# EAGLE design BSPD Test Board rev5 (EAGLE 8.5.2)
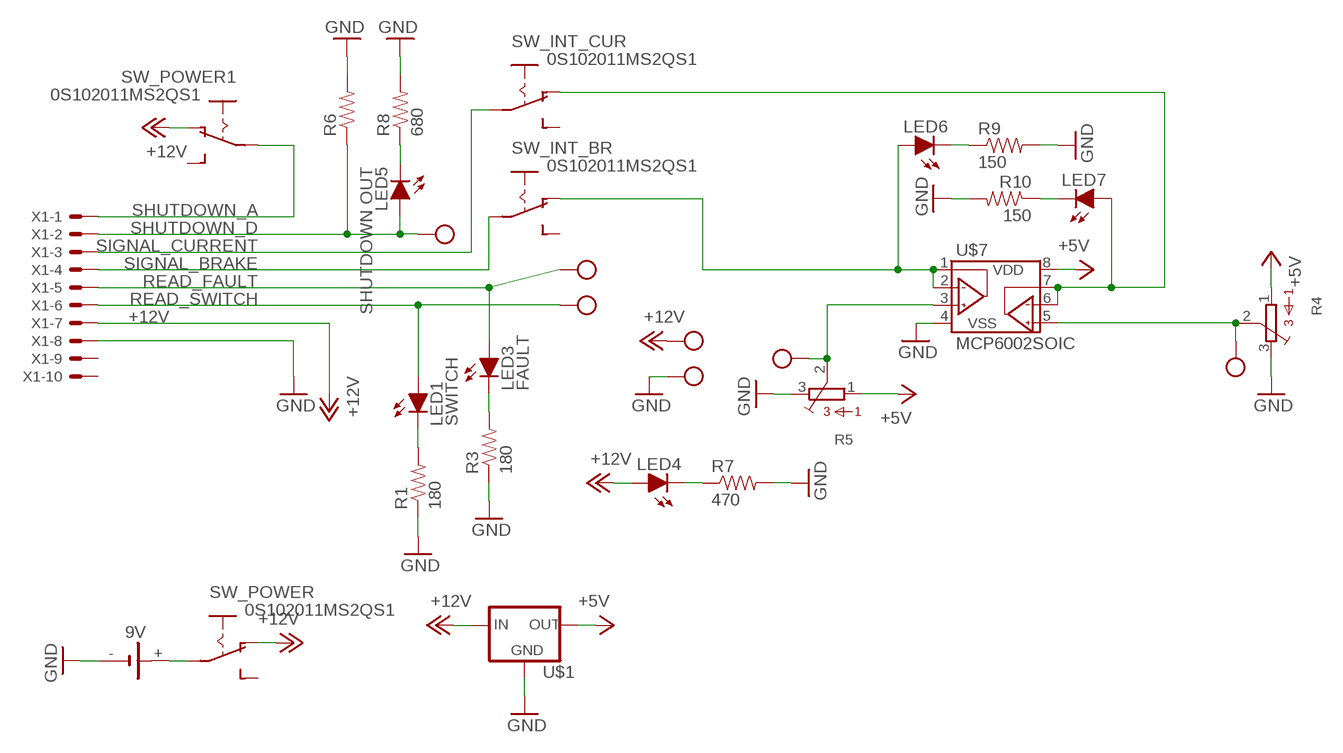
[diagram p0: schematic, sheet 1]

## Parts
9V  1291-79  [1291-79]
LED1  SWITCH  LED-5MM  [LED-5MM]
LED3  FAULT  LED-5MM  [LED-5MM]
LED4  LED-0805  [LED-805]
LED5  SHUTDOWN OUT  LED-5MM  [LED-5MM]
LED6  LED-0805  [LED-805]
LED7  LED-0805  [LED-805]
R1  180  RESISTOR0805-RES  [0805]
R3  180  RESISTOR0805-RES  [0805]
R4  TRIMPOT_3296C  [TRIMPOT_3296]
R5  TRIMPOT_3296C  [TRIMPOT_3296]
R6  RESISTORPTH-1/2W  [AXIAL-0.5]
R7  470  RESISTOR0805-RES  [0805]
R8  680  RESISTOR0805-RES  [0805]
R9  150  RESISTOR0805-RES  [0805]
R10  150  RESISTOR0805-RES  [0805]
SW_INT_BR  0S102011MS2QS1  [0S102011MS2QS1]
SW_INT_CUR  0S102011MS2QS1  [0S102011MS2QS1]
SW_POWER  0S102011MS2QS1  [0S102011MS2QS1]
SW_POWER1  0S102011MS2QS1  [0S102011MS2QS1]
U$1  5VREG_LM340-NLM340MPX-5.0/NOPB  [SOT223]
U$2  TEST_POINT  [TEST_POINT]
U$3  TEST_POINT  [TEST_POINT]
U$4  TEST_POINT  [TEST_POINT]
U$5  TEST_POINT  [TEST_POINT]
U$6  TEST_POINT  [TEST_POINT]
U$7  MCP6002SOIC  [SOIC-08]
U$8  TEST_POINT  [TEST_POINT]
U$10  TEST_POINT  [TEST_POINT]
X1  CONNECTOR-10  [MINIFIT_5566-10]

## Nets
+5V: R4.1 R5.1 U$1.3(OUT) U$7.8(VDD)
+12V: LED4.A SW_POWER1.P$1(O) SW_POWER.P$1(O) U$1.1(IN) U$5.P$1 X1.7
GND: 9V.- R1.1 R3.1 R4.3 R5.3 R6.P$2 R7.2 R8.2 R9.2 R10.2 U$1.2(GND) U$1.4(GND) U$6.P$1 U$7.4(VSS) X1.8
N$1: LED1.K(C) R1.2
N$3: LED3.K(C) R3.2
N$4: R4.2 U$2.P$1 U$7.5(VINB+)
N$5: R5.2 U$3.P$1 U$7.3(VINA+)
N$6: 9V.+ SW_POWER.P$2(P)
N$7: LED4.C R7.1
N$8: LED6.A SW_INT_BR.P$1(O) U$7.1(VOUTA) U$7.2(VINA-)
N$9: LED7.A SW_INT_CUR.P$1(O) U$7.6(VINB-) U$7.7(VOUTB)
N$10: LED6.C R9.1
N$11: LED5.K(C) R8.1
N$12: LED7.C R10.1
N$13: SW_POWER1.P$2(P) X1.1
READ_FAULT: LED3.A U$8.P$1 X1.5
READ_SWITCH: LED1.A U$10.P$1 X1.6
SHUTDOWN_D: LED5.A R6.P$1 U$4.P$1 X1.2
SIGNAL_BRAKE: SW_INT_BR.P$2(P) X1.4
SIGNAL_CURRENT: SW_INT_CUR.P$2(P) X1.3
Unconnected: SW_INT_BR.P$3(S) SW_INT_CUR.P$3(S) SW_POWER1.P$3(S) SW_POWER.P$3(S) X1.9 X1.10

## Notes on the sheet
- SHUTDOWN_A

## Library data of the parts
9V = HyTechDevices:1291-79: Keystone Electronics 9V 9 Volt battery holder 1291-79
LED1 LED3-LED7 = HyTechDevices:LED: Light Emitting Diode (LED) Source: Dangerous Prototypes Eagle Library <https://github.com/DangerousPrototypes/Eagle_Part_Library>
R1 R3 R6-R10 = HyTechDevices:RESISTOR: Resistor Basic schematic elements and footprints for 0603, 1206, and PTH resistors.
R4 R5 = HyTechDevices:TRIMPOT_3296: 3296 Series 3/8" Square Trimmer Source <https://github.com/chiengineer/Eagle-Libraries/blob/master/Potentiometers/bourns.lbr>
SW_INT_BR SW_INT_CUR SW_POWER SW_POWER1 = HyTechDevices:0S102011MS2QS1: Slide Switch 0S102011MS2QS1
U$1 = HyTechDevices:5VREG_LM340-N: Voltage Regulator 5v linear voltage regulator Datasheet <http://www.mouser.com/ProductDetail/Texas-Instruments/LM340MPX-50-NOPB/?qs=X1J7HmVL2ZGZwtTFRQ9ItA%3D%3D> MAX current out: 1.5A MAX voltage in: 35V
U$2-U$6 U$8 U$10 = HyTechDevices:TEST_POINT: Keystone Electronics Test Point 5005
U$7 = HyTechDevices:MCP6002: Microchip MCP6002 Dual Channel Op Amp
X1 = HyTechDevices:CONNECTOR-10: Mini-Fit Junior connector 10 pole Source: http://www.molex.com; OC_FARNELL: unknown; OC_NEWARK: unknown

## Board
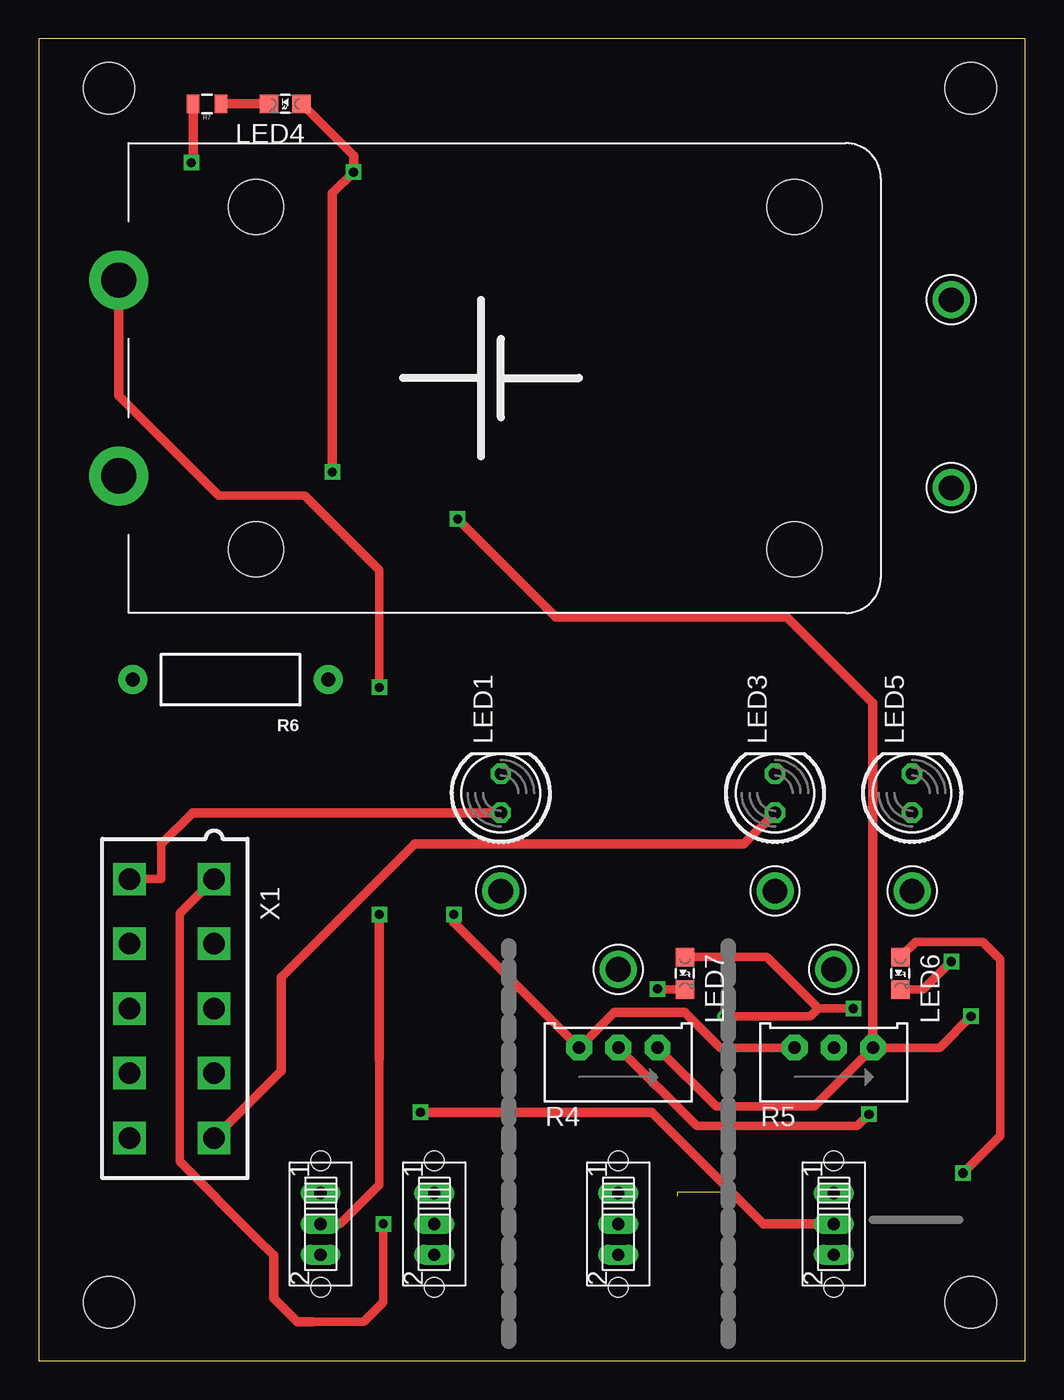
[diagram p1: board, top side]
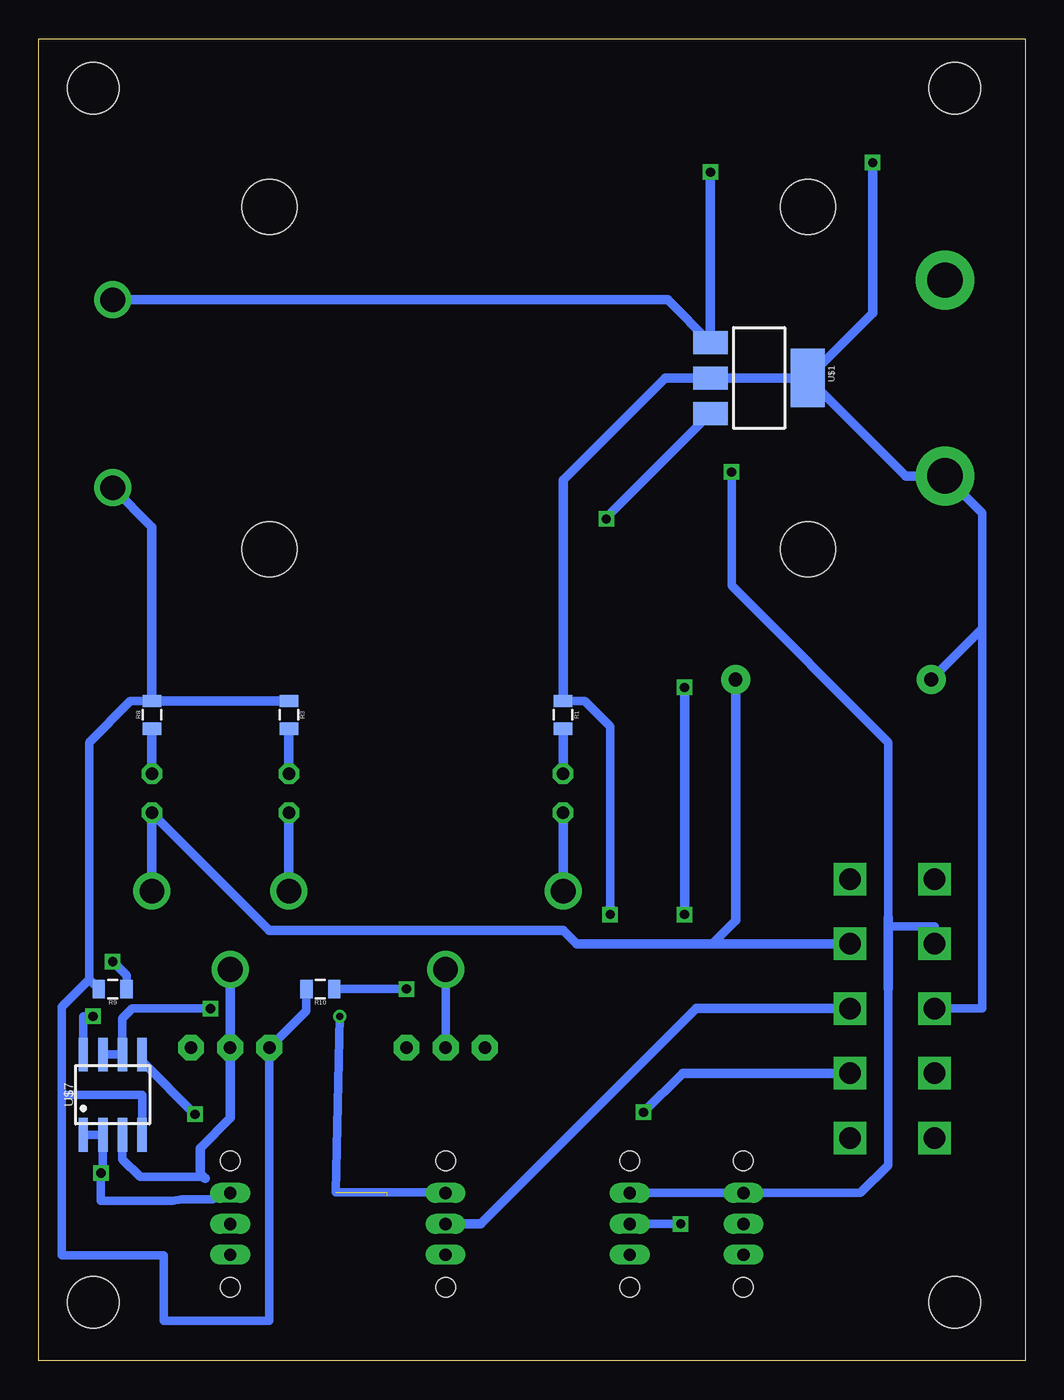
[diagram p2: board, bottom side, seen from below]

Size 63.99 x 85.78 mm. Coordinates in mm from the lower left corner, seen from the top.
Outline: 0,0 63.99,0 63.99,85.78 0,85.78 0,0
Copper layers (1*16): Top 0.035mm / dielectric 1.5mm / Bottom 0.035mm
Design rules "DRC Advanced Circuits": minimum track width 6mil, minimum drill 15mil, track to track 6mil, track to pad 6mil, pad to pad 6mil, via to via 6mil, smd to smd 6mil, copper to edge 40mil, drill to drill 6mil, minimum pad ring 10mil, minimum via ring 8mil, stop-mask expansion 4mil, vias tented up to drill 0mil, thermal gap 10mil
Holes 3.33 mm at 4.57,3.81 60.45,3.81 60.45,82.55 4.57,82.55

### Footprints (pad centres in the part's own frame; a part is rotated, then mirrored left to right if it is on the bottom)
1291-79 = drill 2.286 pad 3.81: + 43.815,-6.35; - 43.815,6.35 | hole 3.556: 0,11.113; 0,-11.113; 34.925,-11.113; 34.925,11.113
LED-5MM = drill 0.813 octagon: A -1.27,0; K 1.27,0
LED-805 = smd 1.2 x 1.2: A 0,-1.05; C 0,1.05
0805 = smd 0.8 x 1.2: 1 -0.9,0; 2 0.9,0
TRIMPOT_3296 = drill 0.813 pad 1.676 octagon: 1 2.54,1.27; 2 0,1.27; 3 -2.54,1.27
AXIAL-0.5 = drill 0.9 pad 1.88: P$1 -6.35,0; P$2 6.35,0
0S102011MS2QS1 = drill 0.8 long: P$1 -2,0; P$2 0,0; P$3 2,0 | hole 1.27: 4.102,0; -4.102,0
SOT223 = smd 1.5 x 2.235: 1 -2.3,-3.15; 2 0,-3.15; 3 2.3,-3.15 | smd 3.8 x 2.2: 4 0,3.15
TEST_POINT = drill 1.6: P$1 0,0
SOIC-08 = smd 0.6 x 2.2: 1 -1.905,-2.6; 2 -0.635,-2.6; 3 0.635,-2.6; 4 1.905,-2.6; 5 1.905,2.6; 6 0.635,2.6; 7 -0.635,2.6; 8 -1.905,2.6
MINIFIT_5566-10 = drill 1.4 square: 1 8.4,-2.75; 2 4.2,-2.75; 3 0,-2.75; 4 -4.2,-2.75; 5 -8.4,-2.75; 6 8.4,2.75; 7 4.2,2.75; 8 0,2.75; 9 -4.2,2.75; 10 -8.4,2.75

### Placement (x,y rotation side)
9V  49.02,63.75 180 top
LED1  29.97,36.83 90 top
LED3  47.75,36.83 90 top
LED4  16,81.53 90 top
LED5  56.64,36.83 90 top
LED6  55.88,25.15 180 top
LED7  41.91,25.15 180 top
R1  29.97,41.91 270 bottom
R3  47.75,41.91 270 bottom
R4  37.59,19.05 0 top
R5  51.56,19.05 0 top
R6  12.45,44.2 180 top
R7  10.92,81.53 180 top
R8  56.64,41.91 90 bottom
R9  59.18,24.13 180 bottom
R10  45.72,24.13 180 bottom
SW_INT_BR  51.56,8.89 270 top
SW_INT_CUR  37.59,8.89 270 top
SW_POWER  18.29,8.89 270 top
SW_POWER1  25.65,8.89 270 top
U$1  17.27,63.75 270 bottom
U$2  37.59,25.4 0 top
U$3  51.56,25.4 0 top
U$4  56.64,30.48 90 top
U$5  59.18,68.83 0 top
U$6  59.18,56.64 0 top
U$7  59.18,17.27 0 bottom
U$8  47.75,30.48 270 top
U$10  29.97,30.48 270 top
X1  8.64,22.86 90 top

### Tracks (layer width: path | path; a pad name or v marks a point on that pad's centre or on a via)
+5V  (via drill 0.6)
  Top 0.559: R4.1 43.94,16.51 50.29,16.51 R5.1 58.42,20.32 v60.45,22.35
  Top 0.61: v27.18,54.61 33.53,48.26 48.51,48.26 54.1,42.67 R5.1
  Bottom 0.559: U$7.8 61.09,22.35 v60.45,22.35
  Bottom 0.61: U$1.3 27.18,54.7 v27.18,54.61
+12V  (via drill 0.6)
  Top 0.61: LED4.A 20.42,78.16 v20.42,77.11 19.05,75.74 v19.05,57.66
  Bottom 0.559: SW_POWER1.P$1 SW_POWER.P$1 10.7,10.89 8.89,12.7 8.89,24.13 | 8.89,28.45 8.89,40.13 19.05,50.29 v19.05,57.66 | 8.89,28.19 5.89,28.19 X1.7
  Bottom 0.61: v20.42,77.11 U$1.1 23.2,68.83 U$5.P$1 | 8.89,24.13 8.89,28.19 8.89,28.45 8.89,28.76
GND  (via drill 0.6)
  Top 0.559: R5.3 44.2,20.32 41.91,22.61
  Top 0.61: v9.91,77.72 10.02,77.84 R7.2 | 41.91,22.61 37.34,22.61 R4.3 26.92,28.45 v26.92,28.96
  Bottom 0.559: R10.2 46.62,22.72 R5.3 49.02,2.6 55.88,2.6 55.88,6.86 62.48,6.86 62.48,17.27 | 60.71,24.75 R9.2 | 60.71,24.75 60.71,40.13 58.03,42.81 R8.2 | U$7.4 57.28,17.27 62.48,17.27 | 62.48,17.27 62.48,22.98 60.71,24.75 | 9V.- 2.79,54.99 2.79,47.5 | R6.P$2 2.79,47.5 | 26.92,29.46 26.92,41.15 28.59,42.81 R1.1 | 2.79,47.5 2.79,22.86 X1.8
  Bottom 0.61: R3.1 R8.2 56.64,54.1 U$6.P$1 | 9V.- 7.77,57.4 U$1.4 | U$1.4 9.91,67.97 v9.91,77.72 | U$1.4 U$1.2 23.37,63.75 29.97,57.15 R1.1 | 26.92,29.46 v26.92,28.96
N$1
  Bottom 0.61: R1.2 LED1.K
N$3
  Bottom 0.61: R3.2 LED3.K
N$4  (via drill 0.6)
  Top 0.559: v53.85,16 53.09,15.24 42.67,15.24 R4.2
  Bottom 0.559: U$7.5 57.21,19.36 v53.85,16 | U$2.P$1 R4.2
N$5
  Bottom 0.559: U$7.3 58.55,13.08 57.4,11.94 53.27,11.94 53.27,11.84 53.18,11.84
  Bottom 0.61: U$3.P$1 R5.2 51.56,15.76 53.52,13.8 53.52,12.18 53.18,11.84
N$6  (via drill 0.6)
  Top 0.559: SW_POWER.P$2 19.56,8.89 22.1,11.43 22.1,19.56 | 10.67,57.15 11.68,56.13 17.27,56.13 22.1,51.31 v22.1,43.69
  Top 0.61: 9V.+ 5.21,62.61 10.67,57.15 | v22.1,28.96 22.1,19.56
  Bottom 0.61: v22.1,43.69 v22.1,28.96
N$7
  Top 0.61: R7.1 LED4.C
N$8  (via drill 0.6)
  Top 0.559: LED6.A 56.86,27.18 61.21,27.18 62.36,26.04 62.36,14.61 v59.94,12.19
  Bottom 0.559: U$7.1 U$7.2 59.82,12.19 v59.94,12.19 59.94,10.38 55.31,10.38 54.7,10.48 52.73,10.48 SW_INT_BR.P$1
N$9  (via drill 0.45, 0.6)  (2 unrouted)
  Top 0.559: LED7.A 47.21,26.2 50.55,22.86 | 50.55,22.86 v52.83,22.86 | 50.55,22.86 50.04,22.35 v44.45,22.35
  Bottom 0.559: U$7.7 U$7.6 58.55,22.23 57.91,22.86 v52.83,22.86 | v44.45,22.35 44.7,10.92 37.85,10.92 SW_INT_CUR.P$1
N$10  (via drill 0.6)
  Top 0.559: LED6.C 57.37,24.1 v59.18,25.91
  Bottom 0.559: v59.18,25.91 58.28,25.01 R9.1
N$11
  Bottom 0.61: R8.1 LED5.K
N$12  (via drill 0.6)
  Top 0.559: LED7.C 40.17,24.1 v40.13,24.13
  Bottom 0.559: v40.13,24.13 R10.1
N$13  (via drill 0.6)
  Top 0.559: X1.1 9.14,29.02 9.14,12.95 14.1,8 | 17.78,2.54 21.08,2.54 22.35,3.81 v22.35,8.89
  Top 0.61: 17.78,2.54 16.76,2.54 15.24,4.06 15.24,6.86 14.1,8
  Bottom 0.559: v22.35,8.89 SW_POWER1.P$2
READ_FAULT
  Top 0.61: X1.5 15.75,18.82 15.75,24.89 24.38,33.53 45.72,33.53 LED3.A
  Bottom 0.61: LED3.A U$8.P$1
READ_SWITCH
  Top 0.559: 7.96,33.53 7.96,31.26 X1.6
  Top 0.61: 7.96,33.53 9.99,35.56 LED1.A
  Bottom 0.61: LED1.A U$10.P$1
SHUTDOWN_D
  Bottom 0.61: 20.32,27.06 X1.2 | U$4.P$1 LED5.A 49.02,27.94 29.97,27.94 29.09,27.06 20.32,27.06 | R6.P$1 18.8,28.58 20.32,27.06
SIGNAL_BRAKE  (via drill 0.6)
  Top 0.61: SW_INT_BR.P$2 46.99,8.89 39.75,16.13 v24.77,16.13
  Bottom 0.61: X1.4 22.23,18.66 v24.77,16.13
SIGNAL_CURRENT
  Bottom 0.61: SW_INT_CUR.P$2 35.31,8.89 21.34,22.86 X1.3

### Text on the board
tDocu: HyTech 2017 BSPD Test Board rev3 | POWER | BATT | GND | ON | OFF | BATT | SC_IN | CURRENT | BRAKE